# EAGLE design openSX70_MEROE_V7_20190603 (EAGLE 9.3.2)
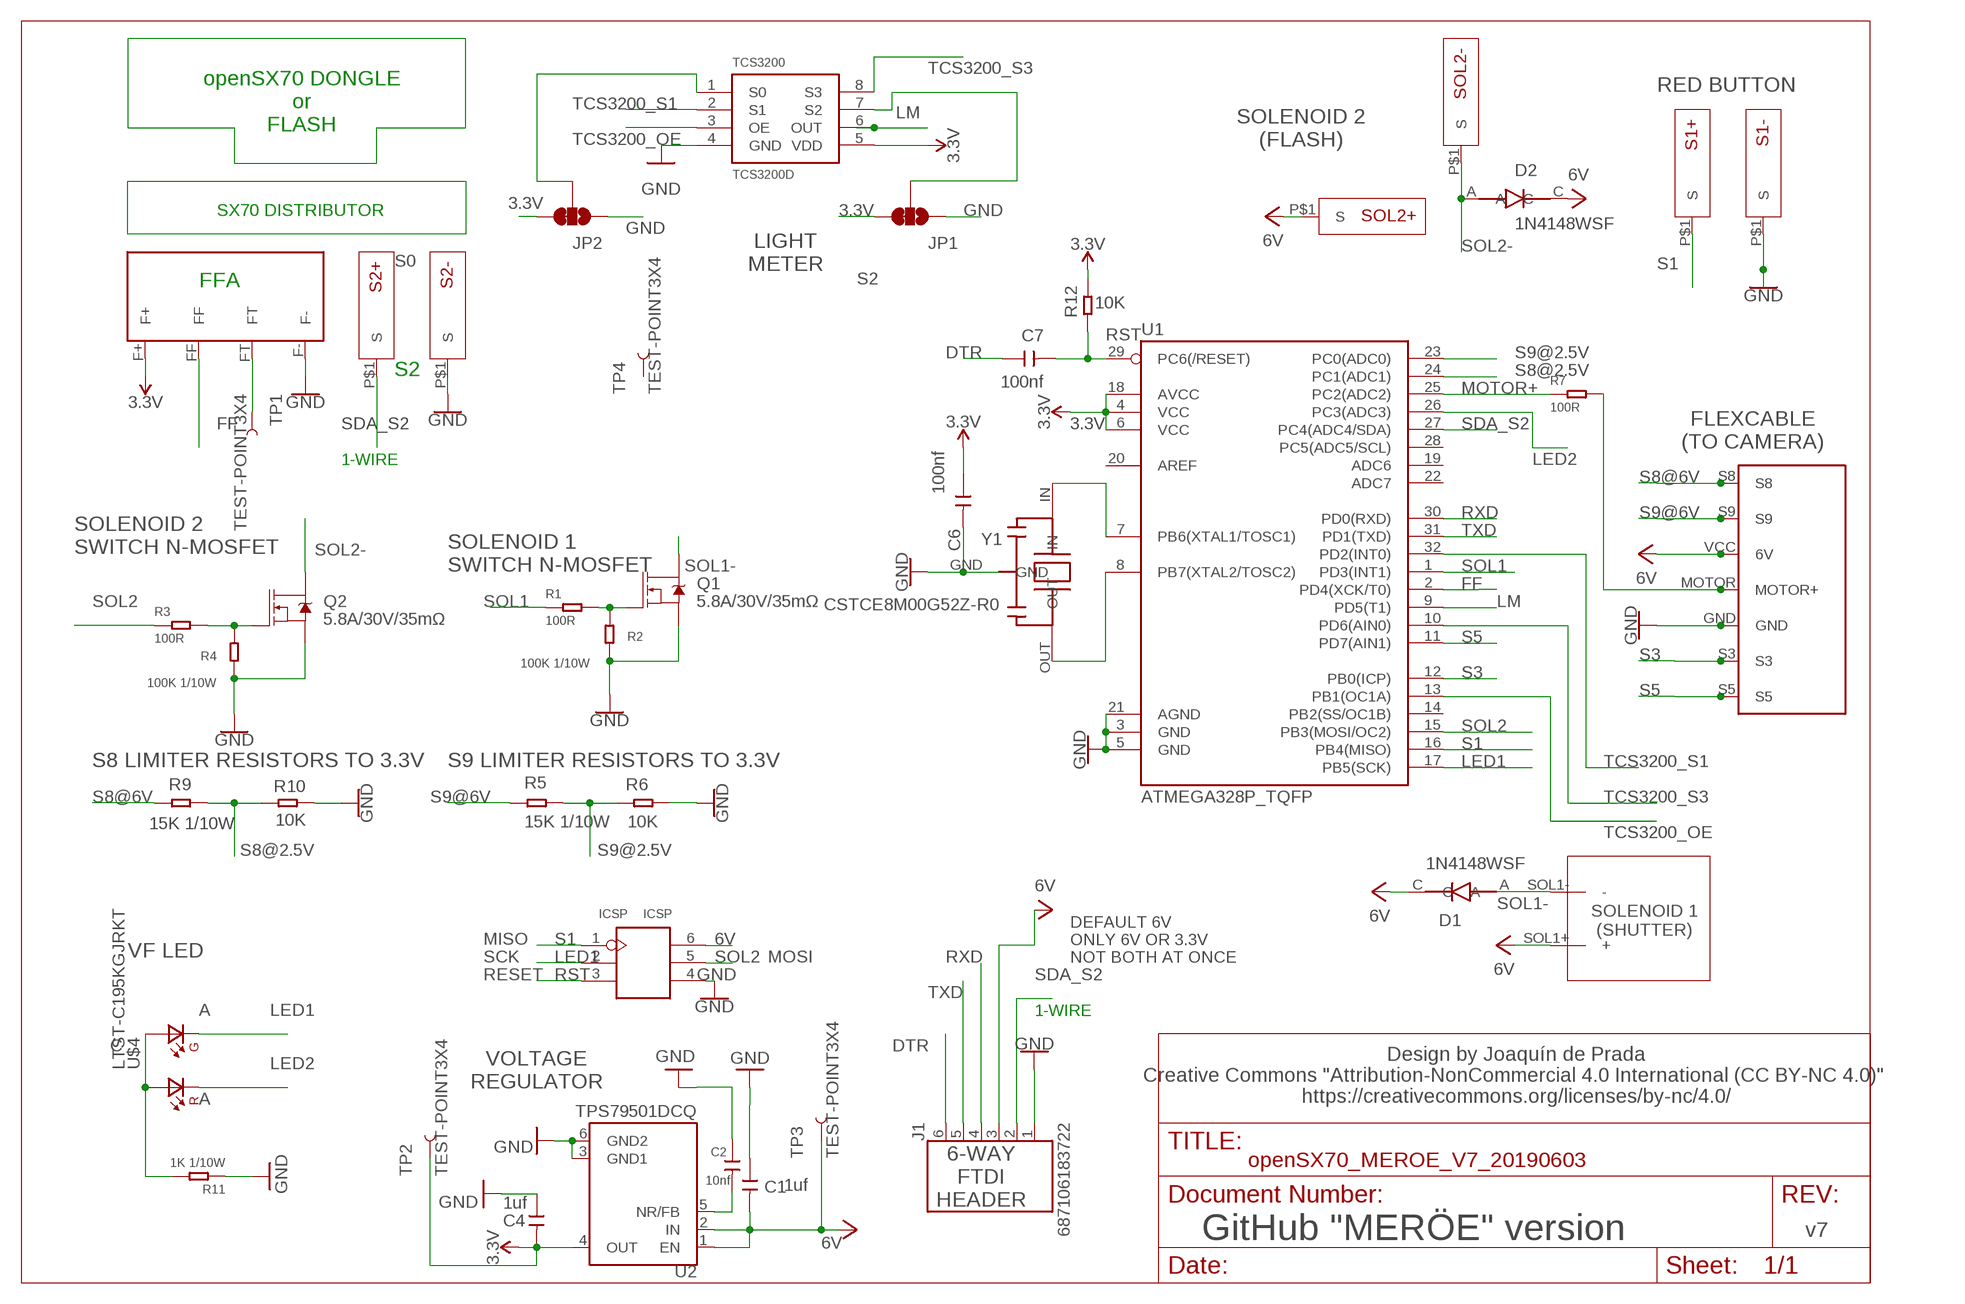
[diagram p0: schematic, sheet 1]

## Parts
C1  1uf  CERAMIC-10UF-10V-10%-X5R(0603)  [C0603]
C2  10nf  CERAMIC-100NF-50V-10%-X7R(0603)  [C0603]
C4  1uf  CERAMIC-10UF-10V-10%-X5R(0603)  [C0603]
C6  100nf  CERAMIC-100NF-50V-10%-X7R(0603)  [C0603]
C7  100nf  CERAMIC-100NF-50V-10%-X7R(0603)  [C0603]
D1  1N4148WSF  1N4148WS  [SODFL2512X100N]
D2  1N4148WSF  1N4148WS  [SODFL2512X100N]
ICSP  ICSP  [H2X3-2.54]
J1  687106183722  [687106183722]
JP1  S2  JUMPER-SMT_3_1-NC_TRACE_SILK  [SMT-JUMPER_3_1-NC_TRACE_SILK]
JP2  S0  JUMPER-SMT_3_1-NC_TRACE_SILK  [SMT-JUMPER_3_1-NC_TRACE_SILK]
Q1  5.8A/30V/35mΩ  MOSFET-NCH-AO3404A  [SOT23-3]
Q2  5.8A/30V/35mΩ  MOSFET-NCH-AO3404A  [SOT23-3]
R1  100R  SMD-RES-100R-5%-1/10W(0603)  [R0603]
R2  100K 1/10W  SMD-RES-100K-5%-1/10W(0603)  [R0603]
R3  100R  SMD-RES-100R-5%-1/10W(0603)  [R0603]
R4  100K 1/10W  SMD-RES-100K-5%-1/10W(0603)  [R0603]
R5  15K 1/10W  SMD-RES-15K-1%-1/10W(0603)  [R0603]
R6  10K  SMD-RES-10K-1%-1/10W(0603)  [R0603]
R7  100R  SMD-RES-100R-5%-1/10W(0603)  [R0603]
R9  15K 1/10W  SMD-RES-15K-1%-1/10W(0603)  [R0603]
R10  10K  SMD-RES-10K-1%-1/10W(0603)  [R0603]
R11  1K 1/10W  SMD-RES-1K-5%-1/10W(0603)  [R0603]
R12  10K  SMD-RES-10K-1%-1/10W(0603)  [R0603]
S1+  SX70-S-PAD-NEW  [SX70-S-PAD2]
S1-  SX70-S-PAD-NEW  [SX70-S-PAD2]
S2+  SX70-S-PAD-NEW  [SX70-S-PAD2]
S2-  SX70-S-PAD-NEW  [SX70-S-PAD2]
SOL1  SX70-SOLENOID1-2PADS  [SX70-SOLENOID1-2]
SOL2+  SX70-S-PAD-NEW  [SX70-S-PAD2]
SOL2-  SX70-S-PAD-NEW  [SX70-S-PAD2]
TCS3200  TCS3200D  [SOIC8]
TP1  TEST-POINT3X4  [PAD.03X.04]
TP2  TEST-POINT3X4  [PAD.03X.04]
TP3  TEST-POINT3X4  [PAD.03X.04]
TP4  TEST-POINT3X4  [PAD.03X.04]
U1  ATMEGA328P_TQFP  [TQFP32-08]
U2  TPS79501DCQ  [SOT127P706X180-6N]
U$1  SX70-7-PAD  [SX70-7-PAD-PROPER]
U$2  FFA  SX70-FFA-PAD  [FFA-PAD-PACKAGE]
U$4  LTST-C195KGJRKT  [LTST-BILED-15X16]
Y1  CSTCE8M00G52Z-R0  CSTCE16M0V53-R0  [CFP95P160X100-3N]

## Nets
3.3V: C4.2 C6.1 JP1.3 JP2.3 R12.2 TCS3200.5(VDD) TP2.P$1 U1.4(VCC) U1.6(VCC) U1.18(AVCC) U2.4(OUT) U$2.F+
6V: C1.2 D1.C D2.C ICSP.6(VCC) J1.3 SOL1.SOL1+(+) SOL2+.P$1(S) TP3.P$1 U2.1(EN) U2.2(IN) U$1.VCC(6V)
DTR: C7.1 J1.6
FF: U1.2(PD4(XCK/T0)) U$2.FF
GND: C1.1 C2.1 C4.1 C6.2 ICSP.4(GND) J1.1 JP1.1 JP2.1 Q1.2(S) Q2.2(S) R2.1 R4.1 R6.2 R10.2 R11.1 S1-.P$1(S) S2-.P$1(S) TCS3200.4(GND) U1.3(GND) U1.5(GND) U1.21(AGND) U2.3(GND1) U2.6(GND2) U$1.GND U$2.F- Y1.GND
LED1: ICSP.2(SCK) U1.17(PB5(SCK)) U$4.P$3(K1)
LED2: U1.26(PC3(ADC3)) U$4.P$4(K2)
LM: TCS3200.6(OUT) U1.9(PD5(T1))
MOTOR+: R7.1 U1.25(PC2(ADC2))
MOTOR-HEADER: R7.2 U$1.MOTOR(MOTOR+)
N$1: Q1.1(G) R1.2 R2.2
N$2: R11.2 U$4.P$1(A1) U$4.P$2(A2)
N$3: Q2.1(G) R3.2 R4.2
N$4: U1.7(PB6(XTAL1/TOSC1)) Y1.IN
N$5: TP1.P$1 U$2.FT
N$6: U1.8(PB7(XTAL2/TOSC2)) Y1.OUT
N$7: JP2.2 TCS3200.1(S0)
N$8: JP1.2 TCS3200.7(S2)
N$10: C2.2 U2.5(NR/FB)
RST: C7.2 ICSP.3(RST) R12.1 U1.29(PC6(/RESET))
RXD: J1.4 U1.30(PD0(RXD))
S1: ICSP.1(MISO) S1+.P$1(S) U1.16(PB4(MISO))
S3: U1.12(PB0(ICP)) U$1.S3
S5: U1.11(PD7(AIN1)) U$1.S5
S8@2.5V: R9.2 R10.1 U1.24(PC1(ADC1))
S8@6V: R9.1 U$1.S8
S9@2.5V: R5.2 R6.1 U1.23(PC0(ADC0))
S9@6V: R5.1 U$1.S9
SDA_S2: J1.2 S2+.P$1(S) U1.27(PC4(ADC4/SDA))
SOL1: R1.1 U1.1(PD3(INT1))
SOL1-: D1.A Q1.3(D) SOL1.SOL1-(-)
SOL2: ICSP.5(MOSI) R3.1 U1.15(PB3(MOSI/OC2))
SOL2-: D2.A Q2.3(D) SOL2-.P$1(S)
TCS3200_OE: TCS3200.3(OE) U1.13(PB1(OC1A))
TCS3200_S1: TCS3200.2(S1) U1.32(PD2(INT0))
TCS3200_S3: TCS3200.8(S3) U1.10(PD6(AIN0))
TXD: J1.5 U1.31(PD1(TXD))
Unconnected: TP4.P$1 U1.14(PB2(SS/OC1B)) U1.19(ADC6) U1.20(AREF) U1.22(ADC7) U1.28(PC5(ADC5/SCL))

## Notes on the sheet
- RED BUTTON
- openSX70 DONGLE
  or
  FLASH
- SOLENOID 2
  (FLASH)
- SX70 DISTRIBUTOR
- LIGHT
  METER
- FFA
- S2
- FLEXCABLE
  (TO CAMERA)
- 1-WIRE
- SOLENOID 2
  SWITCH N-MOSFET
- SOLENOID 1
  SWITCH N-MOSFET
- S8 LIMITER RESISTORS TO 3.3V | S9 LIMITER RESISTORS TO 3.3V
- SOLENOID 1
  (SHUTTER)
- MISO
- SCK | MOSI
- VF LED | RESET
- DEFAULT 6V
  ONLY 6V OR 3.3V
  NOT BOTH AT ONCE
- A | 1-WIRE
- C
- VOLTAGE
  REGULATOR
- Design by Joaquín de Prada
  Creative Commons "Attribution-NonCommercial 4.0 International (CC BY-NC 4.0)" 
  https://creativecommons.org/licenses/by-nc/4.0/
- A
- 6-WAY
  FTDI
  HEADER
- v7
- GitHub "MERÖE" version

## Library data of the parts
C1 C4 = Seeed-Capacitor:CERAMIC-10UF-10V-10%-X5R(0603): 302010103; MPN: CC0603KRX5R6BB106; VALUE: 10uf
C2 = Seeed-Capacitor:CERAMIC-100NF-50V-10%-X7R(0603): 302010138; MPN: CC0603KRX7R9BB104; VALUE: 100nf
C6 C7 = Seeed-Capacitor:CERAMIC-100NF-50V-10%-X7R(0603): 302010138; MPN: CC0603KRX7R9BB104
D1 D2 = Common-Parts-Library-Eagle:1N4148WS: 1N4148WS Series 75 V 300 mA Surface Mount Small Signal Diodes - SOD-323F; MANUFACTURER: Fairchild Semiconductor
ICSP = openSX70:ICSP
J1 = 687106183722:687106183722: 687106183722 WR-FPC 0.50mm SMT Horizontal Bottom Contact - Low Profile <http://katalog.we-online.de/media/images/v2/Family_WR-FPC_6871xx183722.jpg> Details see: http://katalog.we-online.de/en/em/FPC_0_5_SMT_ZIF_HORIZONTAL_BOTTOM_CONTACT_LOW_PROFILE_6871xx183722 Created by Yingchun,shan 2016 (C) Wurth Elektronik; AVAILABILITY: Good; DESCRIPTION: CONN FFC BTM 6POS 0.5MM SMD R/A; MF: Wurth Electronics; MP: 687106183722; PACKAGE: None; PRICE: 1.21 USD
JP1 JP2 = SparkFun-Jumpers:JUMPER-SMT_3_1-NC_TRACE: Normally closed trace jumper (1 of 2 connections) This jumper has a trace between two pads so it's normally closed (NC). The other connection is normally open (NO). Use a razor knife to open the connection. For best results follow the IPC guidelines for cutting traces: Cutout at least 0.063 mm (0.005 in). Remove all loose material to clean up the cut area. Seal the cut with an approved epoxy. Reapply solder to reclose the connection, or to close the NO connection.
Q1 Q2 = openSX70:MOSFET-NCH: N-channel MOSFETs Voltage controlled devices that allow control of high current outputs. SparkFun Products: SparkFun OpenScale <https://www.sparkfun.com/products/13261> SparkFun Digital Sandbox <https://www.sparkfun.com/products/12651> SparkFun Monster Moto Shield <https://www.sparkfun.com/products/10182> SparkFun MOSFET Power Controller <https://www.sparkfun.com/products/11214>; PROD_ID: TRANS-12988
R1 R3 R7 = Seeed-Resistor:SMD-RES-100R-5%-1/10W(0603): 301010090; MPN: RC0603JR-07100RL
R2 R4 = Seeed-Resistor:SMD-RES-100K-5%-1/10W(0603): 301010089; MPN: RC0603JR-07100KL
R5 R9 = Seeed-Resistor:SMD-RES-15K-1%-1/10W(0603): 301010241; MPN: RC0603FR-0715KL
R6 R10 R12 = Seeed-Resistor:SMD-RES-10K-1%-1/10W(0603): 301010299; MPN: RC0603FR-0710KL
R11 = Seeed-Resistor:SMD-RES-1K-5%-1/10W(0603): 301010291; MPN: RC0603JR-071KL
S1+ S1- S2+ S2- SOL2+ SOL2- = openSX70:SX70-S-PAD-NEW
SOL1 = openSX70:SX70-SOLENOID1-2PADS
TCS3200 = TCS3200D:TCS3200D; AVAILABILITY: Unavailable; DESCRIPTION: TSL3200 Series 5.5 V Programmable Color Light-To-Frequency Converter - SOIC-8; MF: ams; MP: TCS3200D-TR; PACKAGE: SOIC-8 ams; PRICE: None
TP1-TP4 = SparkFun-Connectors:TEST-POINT: SparkFun Test Points Bare copper test points for troubleshooting or In-Circuit-Testing. These are used by our Production team for verifying production board runs using pogo-pins on test beds. SparkFun Products: SparkFun LSM9DS1 Breakout <https://www.sparkfun.com/products/13284> SparkFun PSOC <https://www.sparkfun.com/products/13714> SparkFun Load Cell Amplifier <https://www.sparkfun.com/products/13879>
U1 = openSX70:ATMEGA328P_TQFP: Popular 328P in QFP Storefront component: ATmega328 - TQFP <https://www.sparkfun.com/products/13448> (COM-13448) Datasheet <http://www.sparkfun.com/datasheets/Components/SMD/ATMega328.pdf> SparkFun Products SparkFun RedBoard - Programmed with Arduino <https://www.sparkfun.com/products/12757> (DEV-12757) Arduino Pro Mini 328 - 5V/16MHz <https://www.sparkfun.com/products/11113> (DEV-11113) Arduino Pro Mini 328 - 3.3V/8MHz <https://www.sparkfun.com/products/11114> (DEV-11114) SparkFun OpenLog <https://www.sparkfun.com/products/13712> (DEV-13712) SparkFun MicroView - OLED Arduino Module <https://www.sparkfun.com/products/12923> (DEV-12923) SparkFun Digital Sandbox <https://www.sparkfun.com/products/12651> (DEV-12651) SparkFun PicoBoard <https://www.sparkfun.com/products/11888> (WIG-11888) Arduino Fio <https://www.sparkfun.com/products/10116> (DEV-10116) LilyPad Arduino 328 Main Board <https://www.sparkfun.com/products/13342> (DEV-13342) SparkFun RedStick <https://www.sparkfun.com/products/13741> (DEV-13741) LilyPad MP3 <https://www.sparkfun.com/products/11013> (DEV-11013) LilyPad Arduino SimpleSnap <https://www.sparkfun.com/products/10941> (DEV-10941) SparkFun Stepoko <https://www.sparkfun.com/products/13899> (ROB-13899) SparkFun Geiger Counter <https://www.sparkfun.com/products/11345> (SEN-11345) SparkFun EL Sequencer <https://www.sparkfun.com/products/12781> (COM-12781) Arduino Pro 328 - 5V/16MHz <https://www.sparkfun.com/products/10915> (DEV-10915) CryptoCape <https://www.sparkfun.com/products/12773> (DEV-12773) SparkFun IR Thermometer Evaluation Board - MLX90614 <https://www.sparkfun.com/products/10740> (SEN-10740) SparkFun RedBot Mainboard <https://www.sparkfun.com/products/12097> (ROB-12097) Arduino Pro 328 - 3.3V/8MHz <https://www.sparkfun.com/products/10914> (DEV-10914) SparkFun Block for Intel® Edison - Arduino <https://www.sparkfun.com/products/13036> (DEV-13036) SparkFun Simon Says - Surface Mount Soldering Kit <https://www.sparkfun.com/products/10935> (KIT-10935) SparkFun 7-Segment Serial Display - Red <https://www.sparkfun.com/products/11441> (COM-11441) SparkFun 7-Segment Serial Display - White <https://www.sparkfun.com/products/11629> (COM-11629) SparkFun 7-Segment Serial Display - Yellow <https://www.sparkfun.com/products/11443> (COM-11443) SparkFun 7-Segment Serial Display - Kelly Green <https://www.sparkfun.com/products/11440> (COM-11440) SparkFun 7-Segment Serial Display - Blue <https://www.sparkfun.com/products/11442> (COM-11442) SparkFun OpenSegment Serial Display - 20mm (Blue) <https://www.sparkfun.com/products/11647> (COM-11647) SparkFun OpenSegment Serial Display - 20mm (Green) <https://www.sparkfun.com/products/11646> (COM-11646) SparkFun OpenSegment Serial Display - 20mm (White) <https://www.sparkfun.com/products/11648> (COM-11648) SparkFun OpenSegment Serial Display - 20mm (Red) <https://www.sparkfun.com/products/11644> (COM-11644) SparkFun OpenSegment Serial Display - 20mm (Yellow) <https://www.sparkfun.com/products/11645> (COM-11645) SparkFun OpenSegment Shield <https://www.sparkfun.com/products/13190> (DEV-13190); PROD_ID: IC-09069
U2 = TPS79501DCQ:TPS79501DCQ: Ultralow-Noise, High-PSRR, Fast, RF, 500-mA Low-Dropout Linear Regulators 6-SOT-223 -40 to 125; AVAILABILITY: Unavailable; DESCRIPTION: Ultralow-Noise, High-PSRR, Fast, RF, 500-mA Low-Dropout Linear Regulators 6-SOT-223 -40 to 125; MF: Texas Instruments; MP: TPS79501DCQ; PACKAGE: SOT-223-6 Texas Instruments; PRICE: None
U$1 = _openSX70:SX70-7-PAD
U$2 = openSX70:SX70-FFA-PAD
U$4 = LTST-C195KGJRKT:LTST-C195KGJRKT; AVAILABILITY: Unavailable; DESCRIPTION: Green/Red 130° Water Clear 35/25 mcd 2 V 0605 Surface Mount Bi-Color LED; MF: Lite-On Inc.; MP: LTST-C195KGJRKT; PACKAGE: 0606 Lite-On; PRICE: None
Y1 = CSTCE16M0V53-R0:CSTCE16M0V53-R0: Ceramic Resonator 16MHz ±0.5% (Tol) ±0.3% (Stability) 15pF 40Ohm 3-Pin CSMD T/R; AVAILABILITY: Good; DESCRIPTION: Ceramic Resonator 16MHz ??0.5% (Tol) ??0.3% (Stability) 15pF 40Ohm 3-Pin CSMD T/R; MF: Murata; MP: CSTCE16M0V53-R0; PACKAGE: SMD-3 Murata; PRICE: 0.28 USD

## Net classes
0 default: width 0.254 mm
1 GND: width 0.61 mm

## Board
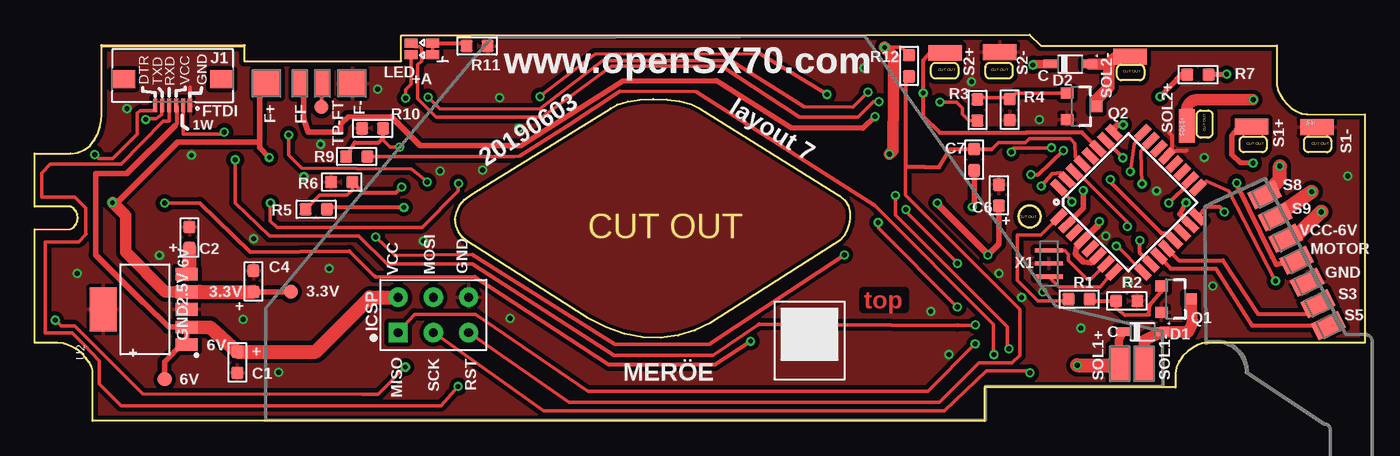
[diagram p1: board, top side]
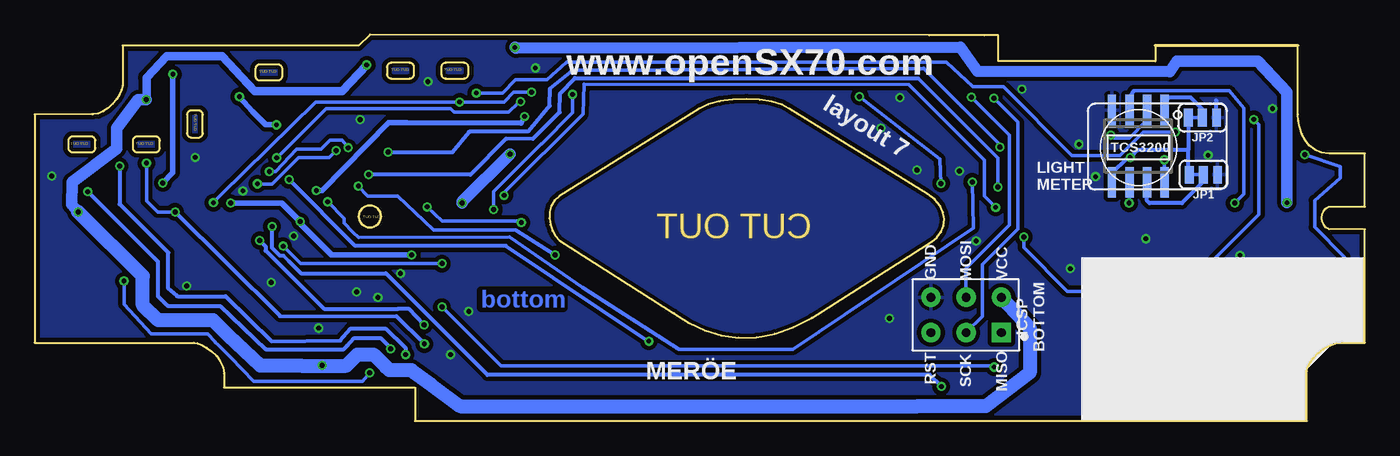
[diagram p2: board, bottom side, seen from below]

Size 95.88 x 27.86 mm. Coordinates in mm from the lower left corner, seen from the top.
Outline: 71.72,15.54 71.88,15.53 72.03,15.48 72.17,15.41 72.29,15.31
Outline: 72.29,15.31 72.39,15.19 72.46,15.06 72.51,14.91 72.52,14.74
Outline: 72.52,14.74 72.51,14.58 72.46,14.43 72.39,14.3 72.29,14.18
Outline: 72.29,14.18 72.17,14.08 72.03,14.01 71.88,13.96 71.72,13.94
Outline: 71.72,13.94 71.56,13.96 71.41,14.01 71.28,14.08 71.16,14.18
Outline: 71.16,14.18 71.06,14.3 70.99,14.43 70.94,14.58 70.92,14.74
Outline: 70.92,14.74 70.94,14.91 70.99,15.06 71.06,15.19 71.16,15.31
Outline: 71.16,15.31 71.28,15.41 71.41,15.48 71.56,15.53 71.72,15.54
Outline: 71.72,15.54 71.57,15.53 71.42,15.48 71.28,15.41 71.16,15.31
Outline: 71.16,15.31 71.06,15.19 70.98,15.05 70.94,14.9 70.92,14.74
Outline: 70.92,14.74 70.94,14.59 70.98,14.44 71.06,14.3 71.16,14.18
Outline: 71.16,14.18 71.28,14.08 71.42,14.01 71.57,13.96 71.72,13.94
Outline: 71.72,13.94 71.88,13.96 72.03,14.01 72.17,14.08 72.29,14.18
Outline: 72.29,14.18 72.39,14.3 72.46,14.44 72.51,14.59 72.52,14.74
Outline: 72.52,14.74 72.51,14.9 72.46,15.05 72.39,15.19 72.29,15.31
Outline: 72.29,15.31 72.17,15.41 72.03,15.48 71.88,15.53 71.72,15.54
Outline: 91.7,22.11 91.77,22.11 95.88,22.11 95.88,5.64 84.4,5.64 84.15,5.6 83.83,5.47 83.48,5.27 83.11,5.01 82.78,4.68 82.5,4.3 82.31,3.87 82.24,3.4 82.24,2.41 68.47,2.41 68.47,0 4.17,0 4.17,3.6 4.11,3.9 3.94,4.23 3.69,4.56 3.36,4.89 2.98,5.18 2.56,5.42 2.11,5.58 1.66,5.64 0,5.64 0,13.82 2.59,13.84 2.81,13.96 2.98,14.15 3.07,14.39 3.1,14.65 3.07,14.91 2.97,15.15 2.81,15.34 2.59,15.45 0,15.46 0,19.29 2.59,19.29 3.14,19.36 3.6,19.56 3.99,19.87 4.3,20.26 4.53,20.7 4.7,21.17 4.79,21.65 4.82,22.11 4.82,27.07 15.1,27.07 15.1,25.94 26.43,25.95 26.43,27.81 27.43,27.82 31.39,27.82 71.71,27.86 72.52,27.07 89.55,27.07 89.55,24.21 89.61,23.9 89.76,23.56 89.97,23.21 90.25,22.87 90.57,22.57 90.93,22.33 91.31,22.17 91.7,22.11
Outline: 83.76,20.77 83.76,22.06 83.77,22.12 83.79,22.19 83.82,22.24 83.86,22.29 83.91,22.33 83.96,22.36 84.03,22.38 84.09,22.39 84.57,22.39 84.64,22.38 84.7,22.36 84.76,22.33 84.81,22.29 84.85,22.24 84.88,22.19 84.9,22.12 84.9,22.06 84.9,20.77 84.9,20.7 84.88,20.64 84.85,20.58 84.81,20.53 84.76,20.49 84.7,20.46 84.64,20.44 84.57,20.44 84.09,20.44 84.03,20.44 83.96,20.46 83.91,20.49 83.86,20.53 83.82,20.58 83.79,20.64 83.77,20.7 83.76,20.77
Outline: 87.19,20.53 88.48,20.53 88.54,20.52 88.61,20.5 88.66,20.47 88.71,20.43 88.75,20.38 88.78,20.32 88.8,20.26 88.81,20.19 88.81,19.71 88.8,19.65 88.78,19.59 88.75,19.53 88.71,19.48 88.66,19.44 88.61,19.41 88.54,19.39 88.48,19.38 87.19,19.38 87.12,19.39 87.06,19.41 87,19.44 86.95,19.48 86.91,19.53 86.88,19.59 86.86,19.65 86.86,19.71 86.86,20.19 86.86,20.26 86.88,20.32 86.91,20.38 86.95,20.43 87,20.47 87.06,20.5 87.12,20.52 87.19,20.53
Outline: 91.84,20.53 93.13,20.53 93.2,20.52 93.26,20.5 93.32,20.47 93.37,20.43 93.41,20.38 93.44,20.32 93.46,20.26 93.46,20.19 93.46,19.71 93.46,19.65 93.44,19.59 93.41,19.53 93.37,19.48 93.32,19.44 93.26,19.41 93.2,19.39 93.13,19.38 91.84,19.38 91.78,19.39 91.71,19.41 91.66,19.44 91.61,19.48 91.57,19.53 91.54,19.59 91.52,19.65 91.51,19.71 91.51,20.19 91.52,20.26 91.54,20.32 91.57,20.38 91.61,20.43 91.66,20.47 91.71,20.5 91.78,20.52 91.84,20.53
Outline: 78.36,25.71 79.65,25.71 79.71,25.7 79.78,25.68 79.83,25.65 79.88,25.61 79.92,25.56 79.95,25.5 79.97,25.44 79.98,25.37 79.98,24.9 79.97,24.83 79.95,24.77 79.92,24.71 79.88,24.66 79.83,24.62 79.78,24.59 79.71,24.57 79.65,24.56 78.36,24.56 78.29,24.57 78.23,24.59 78.17,24.62 78.12,24.66 78.08,24.71 78.05,24.77 78.03,24.83 78.02,24.9 78.02,25.37 78.03,25.44 78.05,25.5 78.08,25.56 78.12,25.61 78.17,25.65 78.23,25.68 78.29,25.7 78.36,25.71
Outline: 68.87,25.84 70.16,25.84 70.23,25.83 70.29,25.81 70.35,25.78 70.39,25.74 70.43,25.69 70.47,25.63 70.49,25.57 70.49,25.51 70.49,25.03 70.49,24.96 70.47,24.9 70.43,24.84 70.39,24.79 70.35,24.75 70.29,24.72 70.23,24.7 70.16,24.69 68.87,24.69 68.8,24.7 68.74,24.72 68.68,24.75 68.64,24.79 68.59,24.84 68.56,24.9 68.54,24.96 68.54,25.03 68.54,25.51 68.54,25.57 68.56,25.63 68.59,25.69 68.64,25.74 68.68,25.78 68.74,25.81 68.8,25.83 68.87,25.84
Outline: 64.95,25.84 66.24,25.84 66.31,25.83 66.37,25.81 66.43,25.78 66.48,25.74 66.52,25.69 66.55,25.63 66.57,25.57 66.57,25.51 66.57,25.03 66.57,24.96 66.55,24.9 66.52,24.84 66.48,24.79 66.43,24.75 66.37,24.72 66.31,24.7 66.24,24.69 64.95,24.69 64.88,24.7 64.82,24.72 64.77,24.75 64.72,24.79 64.68,24.84 64.65,24.9 64.63,24.96 64.62,25.03 64.62,25.51 64.63,25.57 64.65,25.63 64.68,25.69 64.72,25.74 64.77,25.78 64.82,25.81 64.88,25.83 64.95,25.84
Outline: 31.52,16.35 41.5,22.53 42.01,22.82 42.74,23.03 43.62,23.16 44.59,23.21 45.57,23.18 46.5,23.06 47.32,22.84 47.95,22.53 58.05,16.23 58.41,15.9 58.64,15.51 58.76,15.07 58.78,14.61 58.71,14.16 58.56,13.73 58.34,13.34 58.06,13.03 49.78,7.77 48.71,7.05 47.57,6.51 46.38,6.16 45.13,5.99 43.84,6.03 42.53,6.28 41.2,6.75 39.87,7.45 31.22,12.93 30.83,13.23 30.55,13.62 30.37,14.06 30.32,14.55 30.4,15.04 30.62,15.52 30.99,15.97 31.52,16.35
Copper layers (1*16): Top 0.035mm / dielectric 1.5mm / Bottom 0.035mm
Design rules "SeeedStudio_2layer_DRU_no_angle_20140221": minimum track width 6mil, minimum drill 12mil, track to track 6mil, track to pad 6mil, pad to pad 6mil, via to via 6mil, smd to smd 0mil, copper to edge 10mil, drill to drill 10mil, minimum pad ring 10mil, minimum via ring 6mil, stop-mask expansion 2mil, vias tented up to drill 100mil, thermal gap 10mil

### Footprints (pad centres in the part's own frame; a part is rotated, then mirrored left to right if it is on the bottom)
C0603 = smd 0.889 x 0.889: 1 0,0.762; 2 0,-0.762
SODFL2512X100N = smd 1.05 x 0.6: A 1.4,0; C -1.4,0
H2X3-2.54 = drill 0.635 pad 1.397 square: 1 -1.27,2.54 | drill 0.635 pad 1.397: 2 -1.27,0; 3 -1.27,-2.54; 4 1.27,-2.54; 5 1.27,0; 6 1.27,2.54
687106183722 = smd 0.3 x 1: 1 -1.25,1.9; 2 -0.75,1.9; 3 -0.25,1.9; 4 0.25,1.9; 5 0.75,1.9; 6 1.25,1.9 | smd 1.65 x 1.3: Z1 -3.525,0; Z2 3.525,0
SMT-JUMPER_3_1-NC_TRACE_SILK = smd 0.635 x 1.27: 1 -1.016,0; 2 0,0; 3 1.016,0
SOT23-3 = smd 0.8 x 0.9: 1 -0.95,-1; 2 0.95,-1; 3 0,1.1
R0603 = smd 0.889 x 0.889: 1 0,0.762; 2 0,-0.762
SX70-S-PAD2 = smd 2.413 x 1.143: P$1 0.01,0.087
SX70-SOLENOID1-2 = smd 1.372 x 2.54: SOL1+ -0.826,0.127; SOL1- 0.953,0.127
SOIC8 = smd 2.2 x 0.6: 1 -2.6,1.905; 2 -2.6,0.635; 3 -2.6,-0.635; 4 -2.6,-1.905; 5 2.6,-1.905; 6 2.6,-0.635; 7 2.6,0.635; 8 2.6,1.905
PAD.03X.04 = smd 1.016 x 1.016: P$1 0,0
TQFP32-08 = smd 1.27 x 0.559: 1 -4.293,2.8; 2 -4.293,2; 3 -4.293,1.2; 4 -4.293,0.4; 5 -4.293,-0.4; 6 -4.293,-1.2; 7 -4.293,-2; 8 -4.293,-2.8; 17 4.293,-2.8; 18 4.293,-2; 19 4.293,-1.2; 20 4.293,-0.4; 21 4.293,0.4; 22 4.293,1.2; 23 4.293,2; 24 4.293,2.8 | smd 0.559 x 1.27: 9 -2.8,-4.293; 10 -2,-4.293; 11 -1.2,-4.293; 12 -0.4,-4.293; 13 0.4,-4.293; 14 1.2,-4.293; 15 2,-4.293; 16 2.8,-4.293; 25 2.8,4.293; 26 2,4.293; 27 1.2,4.293; 28 0.4,4.293; 29 -0.4,4.293; 30 -1.2,4.293; 31 -2,4.293; 32 -2.8,4.293
SOT127P706X180-6N = smd 0.92 x 1.61: 1 -2.54,-3.005; 2 -1.27,-3.005; 3 0,-3.005; 4 1.27,-3.005; 5 2.54,-3.005 | smd 3.16 x 1.97: 6 0,3.005
SX70-7-PAD-PROPER = smd 1.31 x 2.159: GND 7.875,1.312; MOTOR 6.125,1.312; S3 9.625,1.312; S5 11.375,1.312; S8 0.875,1.312; S9 2.625,1.312; VCC 4.375,1.312
FFA-PAD-PACKAGE = smd 1.95 x 1.95: F+ -3.277,-0.013; F- 2.87,0 | smd 1.05 x 1.95: FF -0.914,0; FT 0.737,0.025
LTST-BILED-15X16 = smd 0.65 x 0.952: P$1 0.425,0.776; P$2 -0.425,0.776; P$3 0.425,-0.776; P$4 -0.425,-0.776
CFP95P160X100-3N = smd 0.3 x 2.032: GND 0.038,0.175; IN -0.912,0.177; OUT 0.992,0.174

### Placement (x,y rotation side)
C1  14.61,4.23 180 top
C2  11.16,13.22 0 top
C4  15.77,10.07 0 top
C6  69.51,16.28 180 top
C7  67.73,18.84 180 top
D1  79.86,6.43 0 top
D2  74.65,25.74 0 top
ICSP  28.74,7.64 90 top
J1  9.94,24.66 180 top
JP1  11.63,17.76 180 bottom
JP2  11.71,21.88 180 bottom
Q1  82.23,8.78 270 top
Q2  75.41,22.69 270 top
R1  75.28,8.78 90 top
R2  78.72,8.66 270 top
R3  67.96,22.43 180 top
R4  70.29,22.45 180 top
R5  20.29,15.26 270 top
R6  22.14,17.23 270 top
R7  83.86,24.98 90 top
R9  23.21,19.07 270 top
R10  24.36,21.1 270 top
R11  31.89,27.05 270 top
R12  63.03,25.61 180 top
S1+  87.72,21.14 0 top
S1-  92.42,21.09 0 top
S2+  65.62,26.46 0 top
S2-  69.56,26.51 0 top
SOL1  79.03,4.05 0 top
SOL2+  83.14,21.28 90 top
SOL2-  78.96,26.19 0 top
TCS3200  16.33,19.82 270 bottom
TP1  20.67,22.64 0 top
TP2  18.46,9.3 0 top
TP3  9.37,3.01 0 top
TP4  55.9,5.93 0 top
U1  78.84,15.77 45 top
U2  7.95,8.03 90 top
U$1  87.1,16.52 296 top
U$2  20.04,24.34 0 top
U$4  27.91,26.83 270 top
Y1  72.94,11.39 270 top

### Tracks (layer width: path | path; a pad name or v marks a point on that pad's centre or on a via)
3.3V  (via drill 0.35)
  Top 0.254: R12.2 62.98,26.42 62.99,26.42 62.47,26.94 v61.27,26.94 | 83.29,17.23 U1.18
  Top 0.305: v81.76,15.71 83.29,17.23 | 16.89,19.01 v16.92,19.01
  Top 0.406: U1.4 75.08,12.51 75.02,12.04 75.6,11.45 76.16,11.39 U1.6 | C6.1 69.51,12.77 v68.71,11.97 | C4.2 TP2.P$1 | U$2.F+ 16.2,23.77 16.2,20.13 | 16.2,20.13 10.31,20.13 5.85,15.66 5.68,15.66 v5.61,15.74 | v16.92,19.01 16.2,19.72 16.2,20.13
  Top 0.508: U1.4 76.62,14.05 v76.74,14.37 | v65.06,15.72 65.06,15.65 68.71,12 v68.71,11.97
  Top 0.813: v61.62,19.25 61.87,19.5 61.91,23.74 61.91,26.31 v61.27,26.94 | v61.62,19.25 | v5.61,15.74 6.55,14.8 6.55,12.18 9.42,9.3 11.91,9.3
  Top 1.016: U2.4 11.91,9.3 C4.2
  Bottom 0.305: 12.72,19.53 16.39,19.53 v16.92,19.01 17.09,19.01 18.24,17.86 TCS3200.5 | JP2.3 12.72,19.53 | JP1.3 12.72,17.84 12.72,19.53
  Bottom 0.406: v81.76,15.71 78.08,15.71 v76.74,14.37 76.74,14.24 74.48,11.97 v68.71,11.97
  Bottom 0.813: v5.61,15.74 5.61,23.72 7.72,25.94 13.54,25.94 14.04,25.2 27.92,25.21 29.15,26.94 61.2,26.87 v61.27,26.94 | v65.06,15.72 65.06,15.82 v61.63,19.25 v61.62,19.25
6V  (via drill 0.35)
  Top 0.254: 87.79,23.17 v87.84,23.17
  Top 0.305: J1.3 10.23,22.72 10.23,21.43 10.12,21.31
  Top 0.406: 10.12,21.31 6.65,17.84 4.39,17.84 4.39,11.99 7.84,8.54 7.87,8.54 9.65,6.76 U2.2 U2.1 10.69,5.49 10.64,5.55 9.37,4.28 TP3.P$1
  Top 0.61: v71.95,25.68 arc-90 72.01,25.74 D2.C | SOL1.SOL1+ 78.14,5.26 78.14,5.82 D1.C
  Top 0.813: SOL2+.P$1 83.05,22.42 arc-90 83.79,23.17 87.79,23.17
  Top 1.016: v75.16,4.01 77.95,4.02 SOL1.SOL1+ | v92.75,15.07 92.72,15.07 91.31,13.7 U$1.VCC | ICSP.6 24.17,8.91 20.24,4.99 C1.2 12.65,6.74 U2.2
  Bottom 0.254: v87.84,23.17 87.95,23.17 87.79,23.17
  Bottom 0.61: v71.95,25.68 73.73,23.77 80.02,23.77 82.36,26.31 86.37,26.31 87.82,24.76 87.79,23.17
  Bottom 0.813: 86.71,7.26 86.97,7.26 | 76.68,3.98 v75.16,4.01 | v92.75,15.07 93.21,15.6 93.19,17.23 89.95,19.64 89.95,21.13 88.44,23.17 v87.84,23.17
  Bottom 1.016: 86.71,7.26 83.03,7.26 81.89,6.12 79.6,3.98 76.68,3.98 73.42,3.98 72.62,4.78 71.46,4.78 70.56,3.89 70.31,3.65 68.74,3.65 67.35,2.65 65.22,1.06 32.2,1.06 27.32,1.06 24.16,3.48 24.16,6.7 ICSP.6 | 86.97,7.26 88.08,8.34 88.08,10.44 v92.75,15.07
DTR  (via drill 0.35)
  Top 0.254: v26.72,3.88 24.77,1.93 23.65,1.93 7.78,1.94 2.89,6.83 1.9,6.83 v1.47,7.27 | v4.33,19.22 4.61,18.94 5.63,18.94 7.38,20.69 7.38,22.2 7.6,22.39 8.67,22.39 J1.6 | v66.52,8.21 66.5,8.21 60.81,13.9 v60.81,14.31
  Top 0.406: v67.59,15.44 67.73,15.6 C7.1
  Bottom 0.254: v4.33,19.22 1.75,18.35 1.75,17.53 3.62,15.9 3.62,13.99 1.47,11.84 v1.47,7.27 | v67.59,15.44 66.53,14.42 60.81,14.43 v60.81,14.31 | v26.72,3.88 26.81,3.97 62.28,3.97 v66.52,8.21
FF  (via drill 0.35)
  Top 0.406: U$2.FF 19.38,24.09 19.38,21.81 19.72,20.84 22.07,20.84 22.07,21.42 22.58,21.93 25.71,21.94 27.78,19.87 34.28,19.87 35.08,19.87 42.39,24.52 49.16,24.53 54.51,21.15 59.72,21.11 v60.57,21.96 | v75.58,16.62 75.58,15.34 U1.2
  Bottom 0.406: v60.57,21.96 60.84,21.48 69.06,21.53 70.36,21.53 75.17,16.62 v75.58,16.62
GND  (via drill 0.35)
  Top 0.305: 83.03,19.52 82.02,19.52 U1.21 81.99,19.48 81.99,20.56 81.76,20.79 | J1.1 11.19,24.06
  Top 0.406: U1.21 81.59,19.11
  Bottom 0.305: JP2.1 10.69,23.1 10.72,23.12
  other vias: 84.94,9.74 78.84,9.99 84.3,19.01 75.41,6.69 71.14,8.9 80.87,16.59 67.54,24.47 72.41,21.73 69.52,10.63 77.22,13.34 72.67,9.3 59.79,25.46 33.5,23.33 15.04,7.32 11.3,19.16 17.58,3.51 94.67,17.66 19.4,17.61 15.8,13.14 34.26,7.4 28.02,12.99 21.23,10.98 24.71,23.93 32.28,18.09 20.6,19.95 34.87,21.12 29.23,18.02 8.99,11.95 3.07,10.63 6.65,22.54 65.91,4.78 64.59,7.91
  pour Top (isolate 0.305): 91.7,22.11 91.77,22.11 95.88,22.11 95.88,5.64 84.4,5.64 84.15,5.6 83.83,5.47 83.48,5.27 83.11,5.01 82.78,4.68 82.5,4.3 82.31,3.87 82.24,3.4 82.24,2.41 68.47,2.41 68.47,0 4.17,0 4.17,3.6 4.11,3.9 3.94,4.23 3.69,4.56 3.36,4.89 2.98,5.18 2.56,5.42 2.11,5.58 1.66,5.64 0,5.64 0,13.82 2.59,13.84 2.81,13.96 2.98,14.15 3.07,14.39 3.1,14.65 3.07,14.91 2.97,15.15 2.81,15.34 2.59,15.45 0,15.46 0,19.29 2.59,19.29 3.14,19.36 3.6,19.56 3.99,19.87 4.3,20.25 4.53,20.7 4.7,21.17 4.79,21.65 4.82,22.11 4.82,27.07 15.1,27.07 15.1,25.94 26.96,25.88 27.02,27.86 71.71,27.86 72.52,27.07 89.55,27.07 89.55,24.21 89.61,23.9 89.76,23.56 89.97,23.21 90.25,22.87 90.57,22.57 90.93,22.33 91.31,22.17
  pour Bottom (isolate 0.305): 91.7,22.11 91.77,22.11 95.88,22.11 95.88,5.64 84.4,5.64 84.15,5.6 83.83,5.47 83.48,5.27 83.11,5.01 82.78,4.68 82.5,4.3 82.31,3.87 82.24,3.4 82.24,2.41 68.47,2.41 68.47,0 4.17,0 4.17,3.6 4.11,3.9 3.94,4.23 3.69,4.56 3.36,4.89 2.98,5.18 2.56,5.42 2.11,5.58 1.66,5.64 0,5.64 0,13.82 2.59,13.84 2.81,13.96 2.98,14.15 3.07,14.39 3.1,14.65 3.07,14.91 2.97,15.15 2.81,15.34 2.59,15.45 0,15.46 0,19.29 2.59,19.29 3.14,19.36 3.6,19.56 3.99,19.87 4.3,20.25 4.53,20.7 4.7,21.17 4.79,21.65 4.82,22.11 4.82,27.07 15.1,27.07 14.98,25.69 26.38,25.81 26.58,27.86 71.71,27.86 72.52,27.07 89.55,27.07 89.55,24.21 89.61,23.9 89.76,23.56 89.97,23.21 90.25,22.87 90.57,22.57 90.93,22.33 91.31,22.17
LED1  (via drill 0.35)
  Top 0.254: 71.61,3.6 68.59,3.6 65.58,0.72 36.69,0.72 ICSP.2 | U1.17 84.45,17.29 86.08,16.59 v89.45,10.09 | v26.75,23.29 26.75,23.89 27.14,24.28 U$4.P$3
  Top 0.305: 71.61,3.6 v71.75,3.46
  Bottom 0.254: v71.75,3.46 72.25,2.87 80.1,2.87 81.76,4.57 82.66,5.47 82.88,5.68 83.41,6.28 87.48,6.28 89.45,8.4 v89.45,10.09 | v26.75,23.29 25,21.54 25,13.83 27.56,11.28 27.56,7.55 ICSP.2
LED2  (via drill 0.35)
  Top 0.254: v60.86,23.02 60.45,23.02 59.33,21.9 55.12,21.9 49.58,25.54 49.54,25.57 41.58,25.57 36.58,21.92 28.92,21.92 27.61,23.23 27.61,25.68 27.89,25.96 27.89,26.85 27.73,27.01 27.38,27.01 U$4.P$4
  Top 0.305: U1.26 78.43,19.01 v78.43,18.98
  Bottom 0.254: v78.43,18.98 74.87,22.54 65.92,22.54 65.66,22.27 61.71,22.27 61.01,22.97 60.91,22.97 v60.86,23.02
LM  (via drill 0.35)
  Top 0.254: U1.9 78.05,12.6 v77.98,12.6 | v66.52,11.35 66.52,11.38 62.8,15.1 v62.8,15.25 | v57.12,23.55 52.29,26.48 40.38,26.47 36.42,23.43 v36.42,23.4 | v16.99,15.71 16.99,14.44 17.47,13.95 27.91,13.95 30.53,16.57 v30.56,17.13
  Bottom 0.254: v77.98,12.6 76.72,11.35 v66.52,11.35 | v57.12,23.55 57.12,22.22 59.36,19.98 59.38,19.95 62.8,16.53 v62.8,15.25 | TCS3200.6 v16.99,15.71 | v36.42,23.4 30.64,18.88 v30.56,17.13
MOTOR+  (via drill 0.35)
  Top 0.406: U1.25 77.57,20.98 77.7,20.98 78.08,21.36 v78.46,21.36 | v81.13,23.39 82.68,25 R7.1
  Bottom 0.406: v78.46,21.36 79.22,21.36 80.17,22.31 v81.13,23.39
MOTOR-HEADER  (via drill 0.35)
  Top 0.406: v86.65,17.17 86.65,17.04 89.23,11.82 89.5,11.28 U$1.MOTOR | v85.92,25.01 R7.2
  Bottom 0.406: v85.92,25.01 85.92,17.9 v86.65,17.17
N$1
  Top 0.254: R1.2 76.11,8.72 76.3,8.72 76.36,8.66
  Top 0.305: Q1.1 81.19,9.29 80.38,8.38 80.32,7.68 78.59,7.64 77.95,8.15 R2.2 76.36,8.66
N$2
  Top 0.254: U$4.P$2 U$4.P$1
  Top 0.305: U$4.P$2 30.92,27.26 R11.2
N$3
  Top 0.254: Q2.1 70.71,23.64 R4.2 70.33,23.33 67.79,23.33 R3.2
N$4
  Top 0.254: U1.7 76.13,10.23 75.86,10.23 74.52,11.56 74.52,11.89 74.51,11.9 74.52,11.98 74.52,12.02 74.25,12.3 Y1.IN
N$5
  Top 0.254: U$2.FT 20.67,24.27 TP1.P$1
N$6
  Top 0.254: U1.8 77.4,10.37 76.81,9.67 73.83,9.67 Y1.OUT
N$7
  Bottom 0.305: TCS3200.1 14.43,23.03 14.13,23.33 12.55,23.33 11.71,22.49 JP2.2
N$8
  Bottom 0.305: JP1.2 11.63,17.25 13.18,15.71 15.52,15.71 15.7,15.88 TCS3200.7
N$10
  Top 1.016: U2.5 11.16,10.78 C2.2
N$17
  pour Top: 31.52,16.35 41.5,22.53 42.01,22.82 42.74,23.03 43.62,23.16 44.59,23.21 45.57,23.18 46.5,23.05 47.32,22.84 47.96,22.53 58.05,16.23 58.41,15.9 58.64,15.51 58.77,15.07 58.78,14.61 58.71,14.16 58.56,13.73 58.34,13.34 58.06,13.03 49.78,7.76 48.71,7.05 47.57,6.51 46.38,6.16 45.13,5.99 43.85,6.03 42.53,6.28 41.2,6.75 39.87,7.45 31.22,12.93 30.83,13.23 30.55,13.62 30.37,14.06 30.32,14.55 30.4,15.04 30.62,15.52 30.99,15.97
N$19
  pour Bottom: 83.76,20.77 83.76,22.06 83.77,22.12 83.79,22.19 83.82,22.24 83.86,22.29 83.91,22.33 83.96,22.36 84.03,22.38 84.09,22.39 84.57,22.39 84.64,22.38 84.7,22.36 84.76,22.33 84.81,22.29 84.85,22.24 84.88,22.19 84.9,22.12 84.9,22.06 84.9,20.77 84.9,20.7 84.88,20.64 84.85,20.58 84.81,20.53 84.76,20.49 84.7,20.46 84.64,20.44 84.57,20.44 84.09,20.44 84.03,20.44 83.96,20.46 83.91,20.49 83.86,20.53 83.82,20.58 83.79,20.64 83.77,20.7
N$20
  pour Bottom: 87.19,20.53 88.48,20.53 88.54,20.52 88.61,20.5 88.66,20.47 88.71,20.43 88.75,20.38 88.78,20.32 88.8,20.26 88.81,20.19 88.81,19.71 88.8,19.65 88.78,19.59 88.75,19.53 88.71,19.48 88.66,19.44 88.61,19.41 88.54,19.39 88.48,19.38 87.19,19.38 87.12,19.39 87.06,19.41 87,19.44 86.95,19.48 86.91,19.53 86.88,19.59 86.86,19.65 86.86,19.71 86.86,20.19 86.86,20.26 86.88,20.32 86.91,20.38 86.95,20.43 87,20.47 87.06,20.5 87.12,20.52
N$21
  pour Bottom: 91.84,20.53 93.13,20.53 93.2,20.52 93.26,20.5 93.32,20.47 93.37,20.43 93.41,20.38 93.44,20.32 93.46,20.26 93.46,20.19 93.46,19.71 93.46,19.65 93.44,19.59 93.41,19.53 93.37,19.48 93.32,19.44 93.26,19.41 93.2,19.39 93.13,19.38 91.84,19.38 91.78,19.39 91.71,19.41 91.66,19.44 91.61,19.48 91.57,19.53 91.54,19.59 91.52,19.65 91.51,19.71 91.51,20.19 91.52,20.26 91.54,20.32 91.57,20.38 91.61,20.43 91.66,20.47 91.71,20.5 91.78,20.52
N$22
  pour Bottom: 78.36,25.71 79.65,25.71 79.71,25.7 79.78,25.68 79.83,25.65 79.88,25.61 79.92,25.56 79.95,25.5 79.97,25.44 79.98,25.37 79.98,24.9 79.97,24.83 79.95,24.77 79.92,24.71 79.88,24.66 79.83,24.62 79.78,24.59 79.71,24.57 79.65,24.56 78.36,24.56 78.29,24.57 78.23,24.59 78.17,24.62 78.12,24.66 78.08,24.71 78.05,24.77 78.03,24.83 78.02,24.9 78.02,25.37 78.03,25.44 78.05,25.5 78.08,25.56 78.12,25.61 78.17,25.65 78.23,25.68 78.29,25.7
N$23
  pour Bottom: 68.87,25.84 70.16,25.84 70.23,25.83 70.29,25.81 70.35,25.78 70.39,25.74 70.44,25.69 70.47,25.63 70.49,25.57 70.49,25.5 70.49,25.03 70.49,24.96 70.47,24.9 70.44,24.84 70.39,24.79 70.35,24.75 70.29,24.72 70.23,24.7 70.16,24.69 68.87,24.69 68.8,24.7 68.74,24.72 68.69,24.75 68.64,24.79 68.6,24.84 68.56,24.9 68.55,24.96 68.54,25.03 68.54,25.5 68.55,25.57 68.56,25.63 68.6,25.69 68.64,25.74 68.69,25.78 68.74,25.81 68.8,25.83
N$24
  pour Bottom: 64.95,25.84 66.24,25.84 66.31,25.83 66.37,25.81 66.43,25.78 66.48,25.74 66.52,25.69 66.55,25.63 66.57,25.57 66.57,25.5 66.57,25.03 66.57,24.96 66.55,24.9 66.52,24.84 66.48,24.79 66.43,24.75 66.37,24.72 66.31,24.7 66.24,24.69 64.95,24.69 64.89,24.7 64.82,24.72 64.77,24.75 64.72,24.79 64.68,24.84 64.65,24.9 64.63,24.96 64.62,25.03 64.62,25.5 64.63,25.57 64.65,25.63 64.68,25.69 64.72,25.74 64.77,25.78 64.82,25.81 64.89,25.83
N$25
  pour Bottom: 31.52,16.35 41.5,22.53 42.01,22.82 42.74,23.03 43.62,23.16 44.59,23.21 45.57,23.18 46.5,23.05 47.32,22.84 47.96,22.53 58.05,16.23 58.41,15.9 58.64,15.51 58.77,15.07 58.78,14.61 58.71,14.16 58.56,13.73 58.34,13.34 58.06,13.03 49.78,7.76 48.71,7.05 47.57,6.51 46.38,6.16 45.13,5.99 43.85,6.03 42.53,6.28 41.2,6.75 39.87,7.45 31.22,12.93 30.83,13.23 30.55,13.62 30.37,14.06 30.32,14.55 30.4,15.04 30.62,15.52 30.99,15.97
RST
  Top 0.254: U1.29 75.79,18.28 75.03,19.05 74.99,20.01 74.64,20.36 71.7,20.37 71.4,20.08 69.46,20.07 68.99,19.6 | 62.77,18.31 62.77,16.28 71.01,8.04 71.01,4.73 70.46,4.18 68.06,4.18 65.31,1.43 65.21,1.35 39.37,1.35 38.53,1.33 ICSP.3 | 62.77,18.41 62.87,18.4 62.87,18.31
  Top 0.305: R12.1 62.78,24.6 62.77,18.41 | 62.77,18.31 62.87,18.31 64.19,18.31 65.19,18.31 65.99,19.6 C7.2 68.99,19.6
RXD  (via drill 0.35)
  Top 0.254: v78.78,14.02 78.78,14.34 75.16,17.96 U1.30 | v30.53,2.48 29.28,1.1 6.22,1.09 4.66,2.68 4.66,4.32 3.55,5.47 2.69,6.33 0.76,6.33 0.76,12.91 3.17,12.91 3.73,13.47 3.68,13.52 3.68,15.35 2.88,16.15 0.51,16.15 0.51,17.89 1.13,18.51 6.24,18.52 9.25,21.63 9.69,21.62 9.69,21.9 J1.4
  Bottom 0.254: 77.96,11.93 77.56,11.53
  Bottom 0.305: 77.96,11.93 78.22,11.93 78.78,12.49 v78.78,14.02 | 77.56,11.53 76.69,10.64 70.56,10.64 63.24,3.32 31.38,3.32 v30.53,2.48
S1  (via drill 0.35)
  Top 0.254: ICSP.1 27.37,7.68 31.8,7.68 39.88,2.14 64.39,2.14 v67.79,5.55
  Top 0.305: U1.16 84.49,15.45 85.38,15.45 v85.76,15.07
  Top 0.406: v87.83,18.59 86.9,18.63 86.3,19.2 86.3,20.56 86.84,21.23 S1+.P$1
  Bottom 0.254: v85.76,15.07 87.03,15.07 87.83,15.86 v87.83,18.59
  Bottom 0.305: v85.76,15.07 78.19,7.57 69.79,7.55 v67.79,5.55
S3
  Top 0.305: U1.12 82.47,11.58 85.65,11.58 88.21,7.69 91.74,7.69 U$1.S3
S5
  Top 0.254: U1.11 81.05,11.89
  Top 0.305: 81.05,11.89 81.89,10.98 85.16,10.98 87.77,6.87 U$1.S5
S8@2.5V  (via drill 0.35)
  Top 0.254: U1.24 79.29,19.99 v78.97,18 | 25.13,20.9 R10.1 25.12,20.24 25.61,19.75 v26.31,19.75 | v73.29,19.7 72.88,19.67 71.41,19.67 70.55,19.67 v70.4,19.39
  Top 0.305: R9.2 23.06,20.09 24.8,20.09 25.13,20.42 25.13,20.9
  Bottom 0.254: v78.97,18 78.52,18 77,19.6 75.24,19.6 74.57,20.27 73.72,20.26 v73.29,19.7 | 31.81,25.43 26.31,19.93 v26.31,19.75
  Bottom 0.305: v70.4,19.39 65.76,19.39 64.58,20.84 64.53,20.86 60.33,20.88 58.76,22.72 58.73,23.98 57.12,25.28 31.81,25.43
S8@6V  (via drill 0.35)
  Top 0.254: R9.1 34.61,19.08 34.96,19.11 38.36,21.28 42.19,23.78 47.66,23.75 60.56,15.53 69.11,6.98 69.11,4.83 v69.16,4.78
  Top 1.016: U$1.S8 89.76,17.41 v89.76,18.37
  Bottom 0.305: v89.76,18.37 89.76,15.64 86.26,12.14 86.26,9.55 85.63,9 85.59,8.98 82.12,8.98 78.81,5.74 73.85,5.8 73.11,6.67 70.69,6.67 70.59,6.66 69.16,5.27 v69.16,4.78
S9@2.5V  (via drill 0.35)
  Top 0.254: R5.2 20.55,16.28 22.52,16.28 22.9,16.66 22.9,17.17 | v79.82,17.1 79.73,19.45 U1.23
  Top 0.305: v26.46,16.88 26.03,16.45 23.68,16.45 R6.1 22.9,17.17 | v74.14,19.51 72.36,17.78 v71.82,17.77
  Bottom 0.254: v74.14,19.51 74.64,19.01 76.86,19.01 78.76,17.1 v79.82,17.1 | 32.21,24.71 26.46,18.95 v26.46,16.88
  Bottom 0.305: 32.21,24.71 56.94,24.73 58,23.61 58.03,22.26 59.99,20.34 61.89,20.35 64.47,17.77 v71.82,17.77
S9@6V  (via drill 0.35)
  Top 0.254: v62.04,16.27 62.04,14.86 70.11,6.77 70.11,5.2 v70.24,5.2
  Top 0.305: v26.61,15.41 21.2,15.41 R5.1
  Top 1.016: U$1.S9 v92.05,16.53
  Bottom 0.254: v26.61,15.41 27.42,16.22 27.42,18.81 32.87,24.25 56.28,24.29 56.36,22.15 62.04,16.47 v62.04,16.27
  Bottom 0.305: v92.05,16.53 87,11.48 87,9.01 86.29,8.3 86.23,8.28 82.52,8.28 79.22,5.16 73.6,5.16 73.37,5.42 72.85,5.98 70.96,5.98 70.24,5.26 v70.24,5.2
SDA_S2  (via drill 0.35)
  Top 0.254: J1.2 10.69,20.7 13.53,20.7 v13.66,20.83
  Top 0.305: S2+.P$1 64.54,26.55 64.04,25.99 v64.04,23.66 64.04,21.99 65.25,20.79 71.5,20.79 71.52,20.8 75.5,20.8 U1.27
  Bottom 0.254: v64.04,23.66 62.17,23.66 61.21,24.62 58.96,24.62 57.56,25.88 30.16,25.88 28.25,24.1 26.07,24.1 21.11,19.13 17.67,19.13 15.98,20.83 v13.66,20.83
SOL1
  Top 0.254: U1.1 72.53,13.42 70.84,13.42 70.84,10.12 72.31,8.65 74.3,8.65
  Top 0.305: 74.3,8.65 R1.1
SOL1-
  Top 0.813: Q1.3 83.43,7.03 83.16,6.43 D1.A 79.98,5.8 SOL1.SOL1-
SOL2  (via drill 0.35)
  Top 0.254: v28.36,23.34 29.18,22.52 36.39,22.51 40.95,25.98 50.2,25.99 55.46,22.68 59,22.65 v60.06,23.71 | v65.25,23.01 66.46,23.01 66.89,22.58 66.89,22.14 67.36,21.67 R3.1
  Top 0.406: v83,15.74 82.56,14.91 U1.15
  Bottom 0.254: v83,15.74 82.49,16.28 75.65,23 v65.25,23.01 62.06,23.01 61.37,23.71 60.04,23.71 v60.06,23.71 | ICSP.5 28.74,11.01 25.62,14.12 25.62,20.61 v28.36,23.34
SOL2-
  Top 0.813: SOL2-.P$1 78.23,26.27 arc90 77.44,25.48 | 77.44,25.48 77.44,24.09 76.51,23.16 Q2.3 | D2.A 77.44,25.74 77.44,25.48
TCS3200_OE  (via drill 0.35)
  Top 0.254: v9.37,15.71 11.91,15.71 | 22.68,12.25 24.51,10.42
  Top 0.305: U1.13 81.65,13.52 81.24,13.52 77.55,17.22 v77.55,17.41 | v51.61,5.75 49,4.05 41.4,4.05 31.72,10.4 24.51,10.42 | 11.91,15.71 15.52,12.2 22.68,12.25
  Bottom 0.254: TCS3200.3 16.99,23.33 16.66,23.81 9.78,23.81 8.71,22.55 8.71,16.37 v9.37,15.71
  Bottom 0.305: v77.55,17.41 72.77,12.63 61.92,12.63 51.64,5.75 v51.61,5.75
TCS3200_S1  (via drill 0.35)
  Top 0.254: U1.32 74.83,15.78 v74.78,15.81 | v18.31,20.63 18.31,19.18 19.25,18.24 27.17,18.18 28.29,17.28 v28.29,17.23
  Bottom 0.254: v74.78,15.81 73.58,14.61 73.58,14.26 72.97,13.62 72.54,13.24 61.64,13.27 56.39,9.64 49.45,5.16 41.22,5.16 28.22,13.9 v28.29,17.23 | TCS3200.2 15.7,21.69 16.99,20.4 18.07,20.39 v18.31,20.63
TCS3200_S3  (via drill 0.35)
  Top 0.254: v14.45,18.83 14.45,15.72 16.93,13.33 23.36,13.35 25.4,11.31 31.62,11.31 31.62,11.29 41.75,4.73 48.89,4.73 52.25,6.99
  Top 0.305: U1.10 79.68,12.1 79.68,12.99 v79.65,13.01 | v67.82,6.92 66.52,6.9 52.25,6.99
  Bottom 0.254: TCS3200.8 v14.44,18.82 v14.45,18.83
  Bottom 0.305: v79.65,13.01 79.24,12.6 79.24,12.29 78.55,11.6 78.42,11.47 78.41,11.47 75.03,8.09 69.67,8.09 68.88,8.06 v67.82,6.92
TXD  (via drill 0.35)
  Top 0.254: v8,21.75 8.05,21.8 8.76,21.8 9.14,22.09 J1.5 | v24.58,13.27 25.99,11.93 31.54,12.01 41.82,5.51 48.61,5.52 v58.37,11.97 | U1.31 74.3,17.45 74.24,17.48
  Top 0.305: 74.24,17.48 73.95,17.9 73.36,17.83 v72.55,16.94
  Bottom 0.254: v72.55,16.94 71.89,16.21 69.74,16.21 67.82,14.4 67.14,13.76 63.35,13.76 61.22,13.76 v58.37,11.97 | v8,21.75 7.63,21.38 7.63,14.9 13.18,9.36 21.43,9.36 24.58,12.5 v24.58,13.27

### Text on the board
Top: top
Bottom: bottom
Dimension: CUT OUT | CUT OUT | CUT OUT | CUT OUT | CUT OUT | CUT OUT | CUT OUT | CUT OUT
tPlace: www.openSX70.com | www.openSX70.com | S2+ | S2- | DTR | TXD | RXD | VCC | GND | GND | 20190603 | C | F+ | FF | F- | SOL2- | FTDI | layout 7 | Q2 | 1W | SOL2+ | TP-FT | S1+ | S1- | S8 | S9 | VCC-6V | MOTOR | 6V | X1 | VCC | MOSI | GND | GND | 3.3V | 3.3V | S3 | 2.5V | Q1 | S5 | GND | C | 6V | MISO | SCK | RST | MERÖE | SOL1+ | SOL1- | 6V
bPlace: www.openSX70.com | layout 7 | LIGHT / METER | VCC | MOSI | GND | ICSP / BOTTOM | MISO | SCK | RST | MERÖE
tNames: LED | A+ | + | + | + | + | +
tDocu: Creative Commons "Attribution-NonCommercial 4.0 International (CC BY-NC 4.0)" / https://creativecommons.org/licenses/by-nc/4.0/ | ALL VIAS TENTED | FLAT / CABLE | openSX70 project visit www.openSX70.com / version 7 "MEROE" 20190503 / by Joaquín de Prada